# EAGLE design MoteinoPi (EAGLE 6.4)
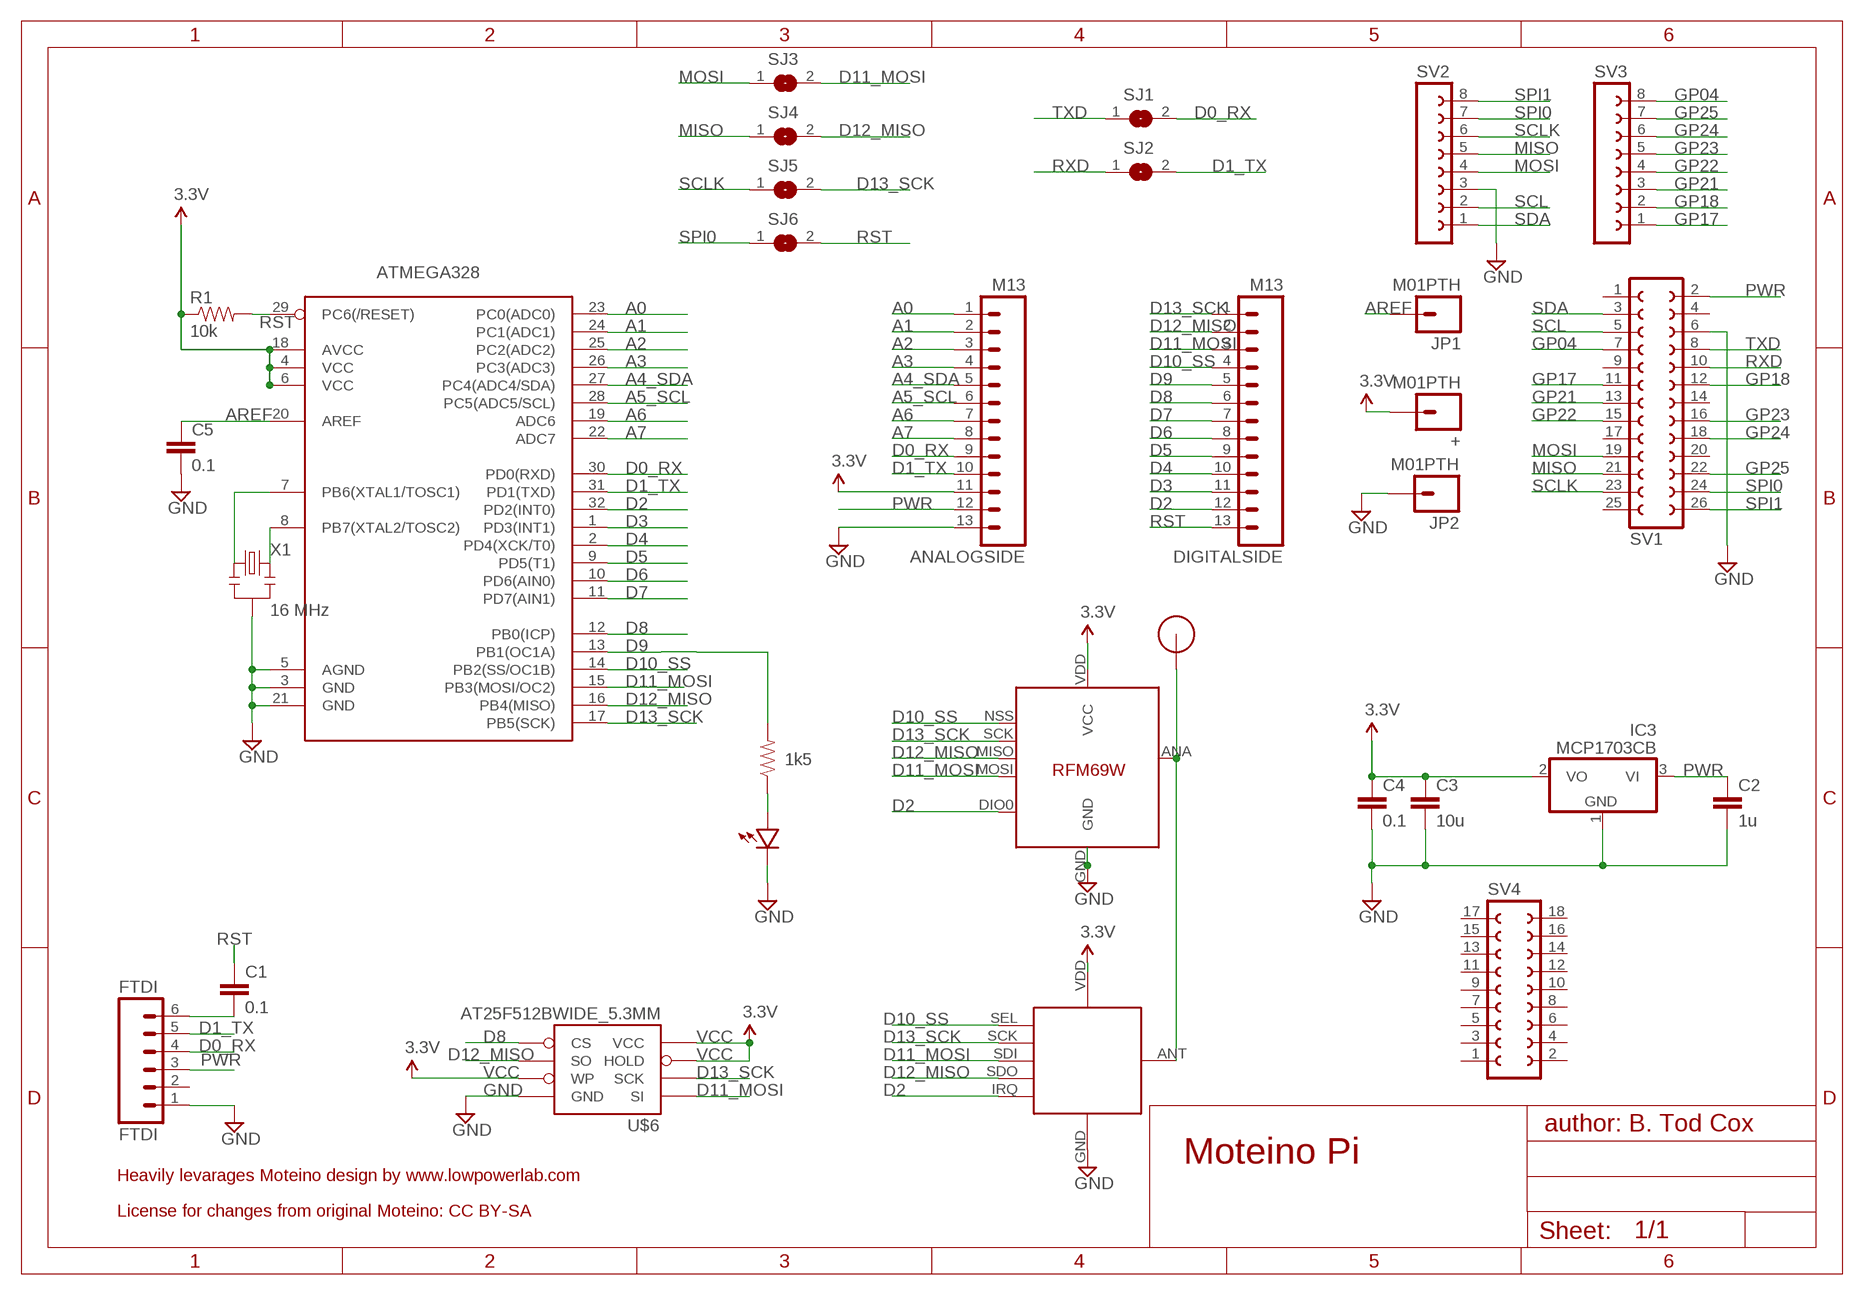
[diagram p0: schematic, sheet 1]

## Parts
+  M01PTH  [1X01]
ANALOGSIDE  M13  [1X13]
ATMEGA328  ATMega-328  ATMEGA168/328TQFP32  [TQFP32-08]
C1  0.1  CAP0603-CAP  [0603-CAP]
C2  1u  CAP0603-CAP  [0603-CAP]
C3  10u  CAP0805-CAP  [0805-CAP]
C4  0.1  CAP0603-CAP  [0603-CAP]
C5  0.1  CAP0603-CAP  [0603-CAP]
DIGITALSIDE  M13  [1X13]
FTDI  FTDI  M06SIP  [1X06]
IC3  MCP1703CB  [SOT23]
JP1  M01PTH  [1X01]
JP2  M01PTH  [1X01]
R1  10k  RESISTOR0603-RES  [0603-RES]
R2  1k5  RESISTOR0603-RES  [0603-RES]
RFM12B  RFM12B_MINPADS  [RFM12B-MINPADS]
SJ1  SJ  [SJ]
SJ2  SJ  [SJ]
SJ3  SJ  [SJ]
SJ4  SJ  [SJ]
SJ5  SJ  [SJ]
SJ6  SJ  [SJ]
SV1  FE13-2  [FE13-2]
SV2  FE08-1  [FE08]
SV3  FE08-1  [FE08]
SV4  FE09-2  [FE09-2]
U$1  RFM12B_ANTENNA  [RFM12B-ANTENNA]
U$2  LED0603  [0603-LED]
U$5  RFM69  [RFM69W-MINPADS]
U$6  AT25F512BWIDE_5.3MM  [SO08WIDE]
X1  16 MHz  RESONATORSMD  [RESONATOR-SMD]

## Nets
A0: ANALOGSIDE.1 ATMEGA328.23(PC0(ADC0))
A1: ANALOGSIDE.2 ATMEGA328.24(PC1(ADC1))
A2: ANALOGSIDE.3 ATMEGA328.25(PC2(ADC2))
A3: ANALOGSIDE.4 ATMEGA328.26(PC3(ADC3))
A4_SDA: ANALOGSIDE.5 ATMEGA328.27(PC4(ADC4/SDA))
A5_SCL: ANALOGSIDE.6 ATMEGA328.28(PC5(ADC5/SCL))
A6: ANALOGSIDE.7 ATMEGA328.19(ADC6)
A7: ANALOGSIDE.8 ATMEGA328.22(ADC7)
AREF: ATMEGA328.20(AREF) C5.1 JP1.1
D0_RX: ANALOGSIDE.9 ATMEGA328.30(PD0(RXD)) FTDI.4 SJ1.2
D1_TX: ANALOGSIDE.10 ATMEGA328.31(PD1(TXD)) FTDI.5 SJ2.2
D2: ATMEGA328.32(PD2(INT0)) DIGITALSIDE.12 RFM12B.IRQ U$5.DIO0
D3: ATMEGA328.1(PD3(INT1)) DIGITALSIDE.11
D4: ATMEGA328.2(PD4(XCK/T0)) DIGITALSIDE.10
D5: ATMEGA328.9(PD5(T1)) DIGITALSIDE.9
D6: ATMEGA328.10(PD6(AIN0)) DIGITALSIDE.8
D7: ATMEGA328.11(PD7(AIN1)) DIGITALSIDE.7
D8: ATMEGA328.12(PB0(ICP)) DIGITALSIDE.6 U$6.1(CS)
D9: ATMEGA328.13(PB1(OC1A)) DIGITALSIDE.5 R2.2
D10_SS: ATMEGA328.14(PB2(SS/OC1B)) DIGITALSIDE.4 RFM12B.SEL U$5.NSS(SEL)
D11_MOSI: ATMEGA328.15(PB3(MOSI/OC2)) DIGITALSIDE.3 RFM12B.SDI(SDI/MOSI) SJ3.2 U$5.MOSI U$6.5(SI)
D12_MISO: ATMEGA328.16(PB4(MISO)) DIGITALSIDE.2 RFM12B.SDO(SDO/MISO) SJ4.2 U$5.MISO U$6.2(SO)
D13_SCK: ATMEGA328.17(PB5(SCK)) DIGITALSIDE.1 RFM12B.SCK SJ5.2 U$5.SCK U$6.6(SCK)
GND: ANALOGSIDE.13 ATMEGA328.3(GND) ATMEGA328.5(AGND) ATMEGA328.21(GND) C2.2 C3.2 C4.2 C5.2 FTDI.1 IC3.1(GND) JP2.1 RFM12B.GND SV1.6 SV2.3 U$2.MINUS U$5.GND U$6.4(GND) X1.2
GP04: SV1.7 SV3.8
GP17: SV1.11 SV3.1
GP18: SV1.12 SV3.2
GP21: SV1.13 SV3.3
GP22: SV1.15 SV3.4
GP23: SV1.16 SV3.5
GP24: SV1.18 SV3.6
GP25: SV1.22 SV3.7
MISO: SJ4.1 SV1.21 SV2.5
MOSI: SJ3.1 SV1.19 SV2.4
N$1: ATMEGA328.7(PB6(XTAL1/TOSC1)) X1.1
N$2: R2.1 U$2.PLUS
N$3: RFM12B.ANT U$1.P$1 U$5.ANA(ANT)
N$20: C1.2 FTDI.6
N$21: ATMEGA328.8(PB7(XTAL2/TOSC2)) X1.3
PWR [power]: ANALOGSIDE.12 C2.1 FTDI.3 IC3.3(VI) SV1.2
RST: ATMEGA328.29(PC6(/RESET)) C1.1 DIGITALSIDE.13 R1.2 SJ6.2
RXD: SJ2.1 SV1.10
SCL: SV1.5 SV2.2
SCLK: SJ5.1 SV1.23 SV2.6
SDA: SV1.3 SV2.1
SPI0: SJ6.1 SV1.24 SV2.7
SPI1: SV1.26 SV2.8
TXD: SJ1.1 SV1.8
VCC: +.1 ANALOGSIDE.11 ATMEGA328.4(VCC) ATMEGA328.6(VCC) ATMEGA328.18(AVCC) C3.1 C4.1 IC3.2(VO) R1.1 RFM12B.VDD U$5.VDD(VCC) U$6.3(WP) U$6.7(HOLD) U$6.8(VCC) ; supply symbol labelled 3.3V
Unconnected: FTDI.2 SV1.1 SV1.4 SV1.9 SV1.14 SV1.17 SV1.20 SV1.25 SV4.1 SV4.2 SV4.3 SV4.4 SV4.5 SV4.6 SV4.7 SV4.8 SV4.9 SV4.10 SV4.11 SV4.12 SV4.13 SV4.14 SV4.15 SV4.16 SV4.17 SV4.18

## Notes on the sheet
- author: B. Tod Cox
- Moteino Pi
- Heavily levarages Moteino design by www.lowpowerlab.com
- License for changes from original Moteino: CC BY-SA

## Library data of the parts
+ JP1 JP2 = SparkFun-Connectors:M01: Header 1 Standard 1-pin 0.1" header. Use with straight break away headers (SKU : PRT-00116), right angle break away headers (PRT-00553), swiss pins (PRT-00743), machine pins (PRT-00117), and female headers (PRT-00115).
ANALOGSIDE DIGITALSIDE = SparkFun-Connectors:M13: 13-pin single row .1" header
ATMEGA328 = LowPowerLab:ATMEGA168/328: Atmel 32-pin 8-bit micro, 16k flash.
C1-C5 = LowPowerLab:CAP: Capacitor Standard 0603 ceramic capacitor, and 0.1" leaded capacitor.
FTDI = SparkFun-Connectors:M06: Header 6 Standard 6-pin 0.1" header. Use with straight break away headers (SKU : PRT-00116), right angle break away headers (PRT-00553), swiss pins (PRT-00743), machine pins (PRT-00117), and female headers (PRT-00115). Molex polarized connector foot print use with SKU : PRT-08094 with associated crimp pins and housings. NOTES ON THE VARIANTS LOCK and LOCK_LONGPADS... This footprint was designed to help hold the alignment of a through-hole component (i.e. 6-pin header) while soldering it into place. You may notice that each hole has been shifted either up or down by 0.005 of an inch from it's more standard position (which is a perfectly straight line). This slight alteration caused the pins (the squares in the middle) to touch the edges of the holes. Because they are alternating, it causes a "brace" to hold the component in place. 0.005 has proven to be the perfect amount of "off-center" position when using our standard breakaway headers. Although looks a little odd when you look at the bare footprint, once you have a header in there, the alteration is very hard to notice. Also, if you push a header all the way into place, it is covered up entirely on the bottom side. This idea of altering the position of holes to aid alignment will be further integrated into the Sparkfun Library for other footprints. It can help hold any component with 3 or more connection pins.
IC3 = linear:MCP1703: 250 mA, 16V, Low Quiescent Current LDO Regulator Source: http://ww1.microchip.com/downloads/en/DeviceDoc/22049b.pdf
R1 R2 = LowPowerLab:RESISTOR: Resistor Basic schematic elements and footprints for 0603, 1206, and PTH resistors.
RFM12B = LowPowerLab:RFM12B_MINPADS
SJ1-SJ6 = jumper:SJ: SMD solder JUMPER
SV1 = con-lsta:FE13-2: FEMALE HEADER; OC_FARNELL: unknown; OC_NEWARK: unknown
SV2 SV3 = con-lsta:FE08-1: FEMALE HEADER; OC_FARNELL: unknown; OC_NEWARK: unknown
SV4 = con-lsta:FE09-2: FEMALE HEADER; OC_FARNELL: unknown; OC_NEWARK: unknown
U$1 = LowPowerLab:RFM12B_ANTENNA
U$2 = LowPowerLab:LED
U$5 = LowPowerLab:RFM69
U$6 = LowPowerLab:AT25F512B: 4-Mbit SPI flash memory
X1 = SparkFun:RESONATOR: Resonator Small SMD resonator. This is the itty bitty 10/20MHz resonators with built in caps. CSTCE10M0G55 and CSTCE20M0V53. Footprint has been reviewed closely but hasn't been tested yet.

## Net classes
1 power: width 0.381 mm

## Board
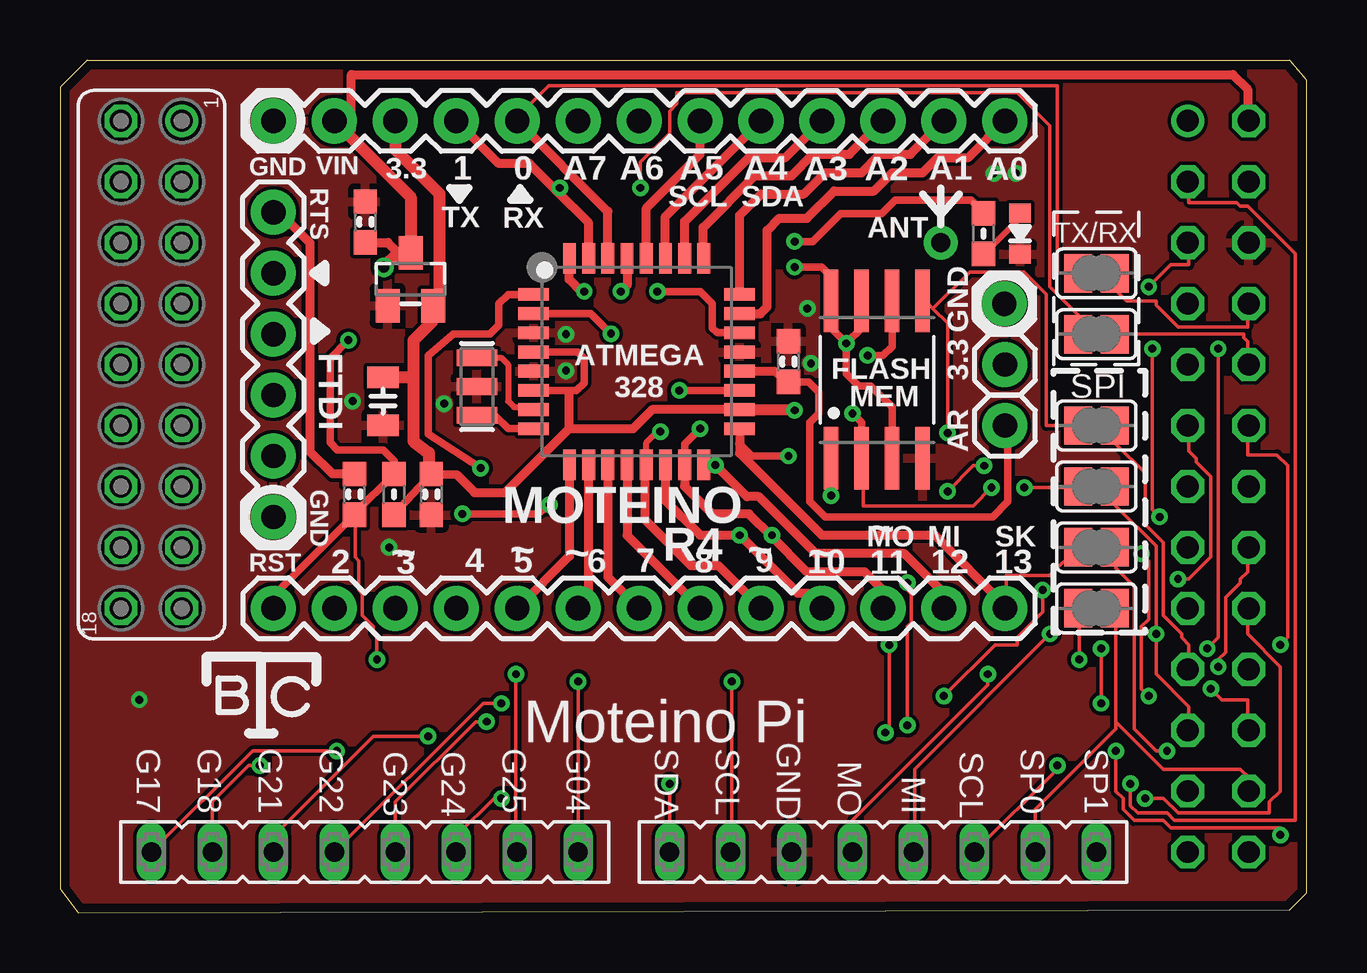
[diagram p1: board, top side]
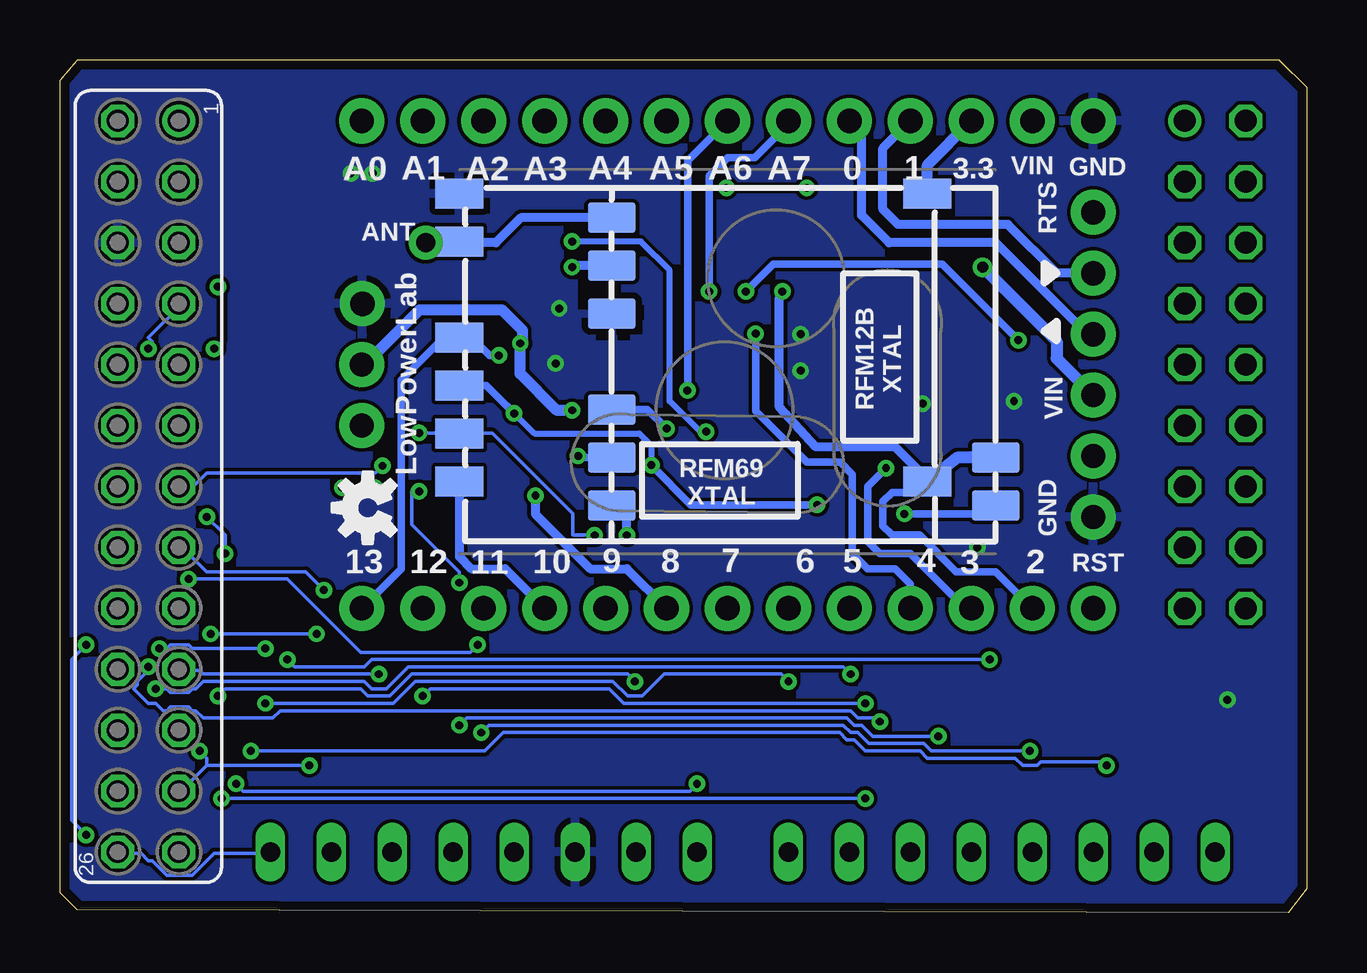
[diagram p2: board, bottom side, seen from below]

Size 51.94 x 35.56 mm. Coordinates in mm from the lower left corner, seen from the top.
Outline: 0.76,0 51.23,0.13 51.94,0.84 51.94,34.72 51.23,35.56 1.14,35.56 0,34.42 0,1.02 0.76,0
Copper layers (1*16): Top 0.0356mm / dielectric 1.5011mm / Bottom 0.0356mm
Design rules "LaenPCBOrder": minimum track width 6mil, minimum drill 13mil, track to track 6mil, track to pad 6mil, pad to pad 6mil, via to via 6mil, smd to smd 6mil, copper to edge 15mil, drill to drill 6mil, minimum pad ring 7mil, minimum via ring 7mil, stop-mask expansion 3mil, vias tented up to drill 0mil, thermal gap 10mil
tRestrict: area 31.8,20.2 to 36.6,24.1; area 13.3,28.2 to 14.4,29.8; area 12.7,21 to 14.2,21.7
bRestrict: area 28.6,25.1 to 30.4,26.2; area 29.1,23.9 to 29.6,24.5; area 28.2,23.9 to 28.7,24.5; area 27.7,24.1 to 28.2,24.8; area 27.6,24.7 to 28.1,25.3; area 34,29.2 to 34.5,29.8

### Footprints (pad centres in the part's own frame; a part is rotated, then mirrored left to right if it is on the bottom)
1X01 = drill 1.016 pad 1.88: 1 0,0
1X13 = drill 1.016 pad 1.88: 1 0,0; 2 2.54,0; 3 5.08,0; 4 7.62,0; 5 10.16,0; 6 12.7,0; 7 15.24,0; 8 17.78,0; 9 20.32,0; 10 22.86,0; 11 25.4,0; 12 27.94,0; 13 30.48,0
TQFP32-08 = smd 1.27 x 0.533: 1 -4.293,2.8; 2 -4.293,2; 3 -4.293,1.2; 4 -4.293,0.4; 5 -4.293,-0.4; 6 -4.293,-1.2; 7 -4.293,-2; 8 -4.293,-2.8; 17 4.293,-2.8; 18 4.293,-2; 19 4.293,-1.2; 20 4.293,-0.4; 21 4.293,0.4; 22 4.293,1.2; 23 4.293,2; 24 4.293,2.8 | smd 0.533 x 1.27: 9 -2.8,-4.293; 10 -2,-4.293; 11 -1.2,-4.293; 12 -0.4,-4.293; 13 0.4,-4.293; 14 1.2,-4.293; 15 2,-4.293; 16 2.8,-4.293; 25 2.8,4.293; 26 2,4.293; 27 1.2,4.293; 28 0.4,4.293; 29 -0.4,4.293; 30 -1.2,4.293; 31 -2,4.293; 32 -2.8,4.293
0603-CAP = smd 1.016 x 0.965: 1 -0.85,0; 2 0.85,0
0805-CAP = smd 0.902 x 1.3: 1 -1,0; 2 1,0
1X06 = drill 1.016 pad 1.88: 1 0,0; 2 2.54,0; 3 5.08,0; 4 7.62,0; 5 10.16,0; 6 12.7,0
SOT23 = smd 1 x 1.4: 1 -0.95,-1.1; 2 0.95,-1.1; 3 0,1.1
0603-RES = smd 1.016 x 0.965: 1 -0.85,0; 2 0.85,0
RFM12B-MINPADS = smd 2 x 1.27: ANT 8,-6; GND 8,-2; IRQ -8,4; SCK 8,4; SDI 8,2; SDO -8,6; SEL 8,6; VDD 8,-4
SJ = smd 1.168 x 1.6: 1 -0.762,0; 2 0.762,0
FE13-2 = drill 0.914: 1 -15.24,1.27 | drill 0.914 octagon: 2 -15.24,-1.27; 3 -12.7,1.27; 4 -12.7,-1.27; 5 -10.16,1.27; 6 -10.16,-1.27; 7 -7.62,1.27; 8 -7.62,-1.27; 9 -5.08,1.27; 10 -5.08,-1.27; 11 -2.54,1.27; 12 -2.54,-1.27; 13 0,1.27; 14 0,-1.27; 15 2.54,1.27; 16 2.54,-1.27; 17 5.08,1.27; 18 5.08,-1.27; 19 7.62,1.27; 20 7.62,-1.27; 21 10.16,1.27; 22 10.16,-1.27; 23 12.7,1.27; 24 12.7,-1.27; 25 15.24,1.27; 26 15.24,-1.27
FE08 = drill 0.813 long: 1 -8.89,0; 2 -6.35,0; 3 -3.81,0; 4 -1.27,0; 5 1.27,0; 6 3.81,0; 7 6.35,0; 8 8.89,0
FE09-2 = drill 0.914: 1 -10.16,1.27 | drill 0.914 octagon: 2 -10.16,-1.27; 3 -7.62,1.27; 4 -7.62,-1.27; 5 -5.08,1.27; 6 -5.08,-1.27; 7 -2.54,1.27; 8 -2.54,-1.27; 9 0,1.27; 10 0,-1.27; 11 2.54,1.27; 12 2.54,-1.27; 13 5.08,1.27; 14 5.08,-1.27; 15 7.62,1.27; 16 7.62,-1.27; 17 10.16,1.27; 18 10.16,-1.27
RFM12B-ANTENNA = drill 0.8 pad 1.422: P$1 0,0
0603-LED = smd 0.8 x 0.9: MINUS -0.85,0; PLUS 0.85,0
RFM69W-MINPADS = smd 2 x 1.27: ANA 8,-5; DIO0 -11.5,5; GND 8,-7; MISO 8,1; MOSI 8,3; NSS 8,5; SCK 8,-1; VDD -11.5,-7
SO08WIDE = smd 0.61 x 2.6: 1 -1.905,-3.269; 2 -0.635,-3.269; 3 0.635,-3.269; 4 1.905,-3.269; 5 1.905,3.286; 6 0.635,3.286; 7 -0.635,3.286; 8 -1.905,3.286
RESONATOR-SMD = smd 0.7 x 1.7: 1 -1.2,0; 2 0,0; 3 1.2,0

### Placement (x,y rotation side)
+  39.37,22.86 270 top
ANALOGSIDE  39.37,33.02 180 top
ATMEGA328  24.03,22.99 0 top
C1  12.27,17.45 90 top
C2  12.73,28.8 90 top
C3  13.46,21.34 270 top
C4  15.47,17.45 270 top
C5  30.35,22.99 90 top
DIGITALSIDE  39.37,12.7 180 top
FTDI  8.89,16.51 90 top
IC3  14.61,26.42 0 top
JP1  39.37,20.32 0 top
JP2  39.34,25.4 0 top
R1  13.92,17.45 90 top
R2  38.48,28.32 90 top
RFM12B  20.96,22.99 180 bottom
SJ1  43.18,26.67 180 top
SJ2  43.18,24.13 180 top
SJ3  43.18,20.32 180 top
SJ4  43.18,17.78 180 top
SJ5  43.18,15.24 180 top
SJ6  43.18,12.7 180 top
SV1  48.26,17.78 270 bottom
SV2  34.29,2.54 0 top
SV3  12.7,2.54 0 top
SV4  3.81,22.86 270 top
U$1  36.7,27.94 0 top
U$2  40,28.32 90 top
U$3  [OSHW-LOGO-S]  39.12,16.89 90 bottom
U$5  27.3,22.99 180 bottom
U$6  34.04,22.22 0 top
X1  17.37,21.95 270 top

### Tracks (layer width: path | path; a pad name or v marks a point on that pad's centre or on a via)
A0
  Top 0.381: ATMEGA328.23 29.18,24.99 29.46,25.27 29.46,28.45 29.97,28.96 31.11,28.96 32.26,30.1 33.91,30.1 34.67,30.86 35.94,30.86 36.58,31.5 37.85,31.5 ANALOGSIDE.1
A1
  Top 0.381: ATMEGA328.24 28.32,29.08 29.21,29.97 30.99,29.97 31.88,30.86 33.4,30.86 34.16,31.62 35.43,31.62 ANALOGSIDE.2
A2
  Top 0.381: ATMEGA328.25 26.8,27.28 26.8,28.57 28.96,30.73 30.48,30.73 31.37,31.62 32.89,31.62 ANALOGSIDE.3
A3
  Top 0.381: ATMEGA328.26 26.03,28.82 28.7,31.5 30.23,31.5 ANALOGSIDE.4
A4_SDA
  Top 0.381: ATMEGA328.27 25.23,29.04 ANALOGSIDE.5
A5_SCL
  Top 0.381: ATMEGA328.28 24.43,29.38 26.67,31.62 ANALOGSIDE.6
A6  (via drill 0.33)
  Top 0.305: ATMEGA328.19 v25.8,21.79
  Bottom 0.305: 25.78,21.72 25.78,31.37 ANALOGSIDE.7
  Bottom 0.381: 25.78,21.72 v25.8,21.79
A7  (via drill 0.33)
  Top 0.305: ATMEGA328.22 27.38,24.19 27.18,24.38 27.18,25.4 26.67,25.91 v24.89,25.91
  Bottom 0.305: v24.89,25.91 24.89,30.73 24.13,31.5 22.99,31.5 21.59,32.89 ANALOGSIDE.8
AREF
  Top 0.305: C5.1 31.2,22.14 31.62,21.72 31.62,20.83 31.24,20.45 31.24,17.14 31.88,16.51 38.86,16.51 39.5,17.14 39.5,20.19 JP1.1
  Top 0.381: ATMEGA328.20 29.78,22.59 C5.1
D0_RX
  Top 0.152: 42.47,26.72 SJ1.2 41.55,26.67 41.55,34.49 20.37,34.49 19.05,33.17
  Top 0.305: 19.05,33.17 ANALOGSIDE.9
  Top 0.381: ATMEGA328.30 22.83,29.24 ANALOGSIDE.9
  Bottom 0.381: FTDI.4 9.14,24.13 12.95,27.94 17.4,27.94 18.54,29.08 18.54,32.51 ANALOGSIDE.9
D1_TX  (via drill 0.33)
  Top 0.152: v24.18,30.23 24.18,31.29 25.4,32.51 25.4,33.43 25.71,33.73 25.71,34.19 39.88,34.19 41.25,32.82 41.25,26.11 42.47,24.89 42.47,24.13 SJ2.2 | v20.83,30.23 20.7,30.1
  Top 0.381: ATMEGA328.31 22.03,28.77 20.7,30.1 19.56,31.24 18.29,31.24 ANALOGSIDE.10
  Bottom 0.152: v20.83,30.23 v24.18,30.23
  Bottom 0.381: FTDI.5 10.41,26.67 12.45,28.7 17.02,28.7 17.65,29.34 17.65,31.88 ANALOGSIDE.10
D2  (via drill 0.33)
  Top 0.381: v21.84,25.91 21.72,25.91 21.21,26.42 21.21,27.13 ATMEGA328.32
  Bottom 0.305: DIGITALSIDE.12 12.95,14.22 14.61,14.22 16.13,15.75 17.27,15.75 17.65,16.13 17.65,17.14 17.27,17.53 16.27,17.53 U$5.DIO0
  Bottom 0.381: 15.34,18.19 15.91,18.19 17.14,19.43 20.45,19.43 21.97,21.08 21.97,25.65 v21.84,25.91
  Bottom 0.406: U$5.DIO0 15.55,17.99 15.34,18.19
  Bottom 0.508: RFM12B.IRQ 14.55,18.99 U$5.DIO0
D3  (via drill 0.33)
  Top 0.305: v17.53,18.54 15.34,19.96 15.34,23.24 16.38,24.13 17.91,24.13 18.29,24.51 18.29,25.4 18.67,25.78 ATMEGA328.1
  Top 0.381: ATMEGA328.1
  Bottom 0.305: DIGITALSIDE.11 14.22,12.7 16.51,14.99 17.78,14.99 18.29,15.49 18.29,17.78 v17.53,18.54
D4  (via drill 0.33)
  Top 0.305: ATMEGA328.2 22.12,24.99 v22.96,24.15
  Top 0.381: 19.66,25.04 ATMEGA328.2
  Bottom 0.305: DIGITALSIDE.10 16.51,13.72 17.14,14.35 18.29,14.35 18.92,14.99 18.92,18.29 19.43,18.8 20.83,18.8 22.96,20.93 v22.96,24.15
D5
  Top 0.381: ATMEGA328.9 21.23,14.88 DIGITALSIDE.9
D6
  Top 0.381: DIGITALSIDE.8 22.03,13.14 ATMEGA328.10
D7
  Top 0.381: ATMEGA328.11 22.83,14 DIGITALSIDE.7
D8  (via drill 0.33)
  Top 0.305: v32.13,17.4 32.12,19.05 U$6.1
  Top 0.381: ATMEGA328.12 23.63,15.74 DIGITALSIDE.6
  Bottom 0.381: v32.13,17.4 32.13,16.64 29.84,14.35 28.32,14.35 DIGITALSIDE.6
D9  (via drill 0.33)
  Top 0.254: ATMEGA328.13 24.43,19.6 24.89,20.07 v25.02,20.07
  Top 0.305: R2.2 38.26,29.43 37.97,29.72 34.8,29.72 34.24,29.16 32.54,29.16 31.37,27.99 v30.61,27.99
  Top 0.381: ATMEGA328.13 24.38,18.61 24.38,16.38 26.29,14.48 27.43,14.48 DIGITALSIDE.5
  Bottom 0.254: v25.02,20.07 25.27,20.07 26.54,21.34 26.54,26.8 27.74,27.99 v30.61,27.99
D10_SS  (via drill 0.33)
  Top 0.381: ATMEGA328.14 25.23,17.19 26.67,15.75 v28.32,15.75 30.73,13.33 31.11,13.33 DIGITALSIDE.4
  Bottom 0.254: 28.32,16.73 RFM12B.SEL
  Bottom 0.381: v28.32,15.75 28.32,16.73 | U$5.NSS 35.3,14.86 34.8,14.35 33.4,14.35 DIGITALSIDE.4
D11_MOSI  (via drill 0.33)
  Top 0.152: 36.37,25.2 36.98,24.59 v36.98,20.02 | 36.37,25.2 36.07,25.5 U$6.5 | v29.67,15.75 29.63,15.71 | SJ3.2 41.1,20.32 41.1,25.81 40.18,26.72 37.9,26.72 36.37,25.2
  Top 0.305: ATMEGA328.15 26.03,19.55 v26.67,20.19
  Top 0.381: ATMEGA328.15 26.03,17.79 27.18,16.64 28.7,16.64 29.63,15.71 31.11,14.22 33.53,14.22 34.29,13.46 DIGITALSIDE.3
  Bottom 0.152: v36.98,20.02 35.31,20.02 U$5.MOSI 35.15,20.02 33.93,20.02 30.58,16.66 30.58,15.75 v29.67,15.75
  Bottom 0.305: v26.67,20.19 27.46,20.99 RFM12B.SDI
D12_MISO  (via drill 0.33)
  Top 0.152: v40.18,17.73 42.32,17.73 SJ4.2 | v38.81,17.73 38.05,16.97 33.48,16.97 33.48,18.95 U$6.2
  Top 0.305: v33.02,20.83 33.4,20.45 U$6.2 | v16.76,16.64 19.89,16.64 v20.4,17.02
  Top 0.381: ATMEGA328.16 27.41,18.69 v27.3,18.67 28.62,17.36 29.12,17.36 31.5,14.99 35.18,14.99 36.83,13.33 DIGITALSIDE.2
  Bottom 0.152: v38.81,17.73 v40.18,17.73
  Bottom 0.254: v33.02,20.83 32.18,19.99 27.81,19.99 27.3,19.48 v27.3,18.67
  Bottom 0.305: U$5.MISO 34.18,21.99 v33.02,20.83 33.34,21.14 | v27.3,18.67 25.65,17.02 v20.4,17.02 | v16.76,16.64 13.3,16.64 RFM12B.SDO
D13_SCK  (via drill 0.33)
  Top 0.152: SJ5.2 41.25,14.07 39.42,14.07 39.42,13 DIGITALSIDE.1
  Top 0.305: v33.65,23.24 34.29,23.24 34.67,23.62 U$6.6 | v30.35,19.05 28.83,19.05 28.32,19.56
  Top 0.381: DIGITALSIDE.1 39.37,12.83 36.45,15.75 31.74,15.75 28.32,19.17 28.32,19.56 ATMEGA328.17
  Bottom 0.305: RFM12B.SCK 30.29,18.99 v30.35,19.05 | DIGITALSIDE.1 37.72,14.35 37.72,22.22 35.96,23.99 U$5.SCK 35.29,24 34.8,24 34.04,23.24 v33.65,23.24
GND  (via drill 0.33 pad 0.69)
  other vias: 3.3,8.89 13.72,15.24 12.19,21.34 21.08,22.61 21.08,24.13 16,21.23 31.29,22.91 31.14,25.2 38.91,30.84 39.83,30.84
  pour Bottom: 0.51,35.31 0.51,0.38 51.69,0.38 51.69,35.31
  pour Top: 0.51,35.31 0.51,0.38 51.69,0.38 51.69,35.31
GP04  (via drill 0.33)
  Top 0.152: v21.59,9.65 SV3.8 | v43.38,11.02 v43.38,8.74 | v47.8,11.02 48.26,11.48 v48.26,23.52
  Bottom 0.152: v21.59,9.65 21.89,9.96 26.77,9.96 27.69,9.04 28.3,9.04 28.91,9.65 37.13,9.65 38.05,8.74 v43.38,8.74 | v43.38,11.02 46.43,11.02 46.58,11.18 47.35,11.18 47.5,11.02 v47.8,11.02 | v48.26,23.52 48.26,23.67 48.11,23.82 48.26,23.98 46.89,25.35 SV1.7
GP17  (via drill 0.33)
  Top 0.152: SV3.1 8.03,6.76 v11.53,6.76 | v34.39,7.52 34.54,7.67 v34.54,11.18 | v46.58,13.92 47.04,13.92 47.95,14.83 47.95,18.19 47.35,18.8 47.35,18.95 47.04,19.25 47.04,20.32 SV1.11
  Bottom 0.152: v11.53,6.76 15.65,6.76 15.95,7.06 18.24,7.06 18.69,7.52 19,7.52 19.3,7.82 34.09,7.82 v34.39,7.52 | v34.54,11.18 34.85,10.87 39.42,10.87 42.47,13.92 v46.58,13.92
GP18  (via drill 0.33)
  Top 0.152: SV3.2 6.35,4.62 7.87,6.15 v8.33,6.15 | v43.99,6.76 43.99,5.08 44.3,4.78 44.3,4.32 44.75,3.86 45.97,3.86 46.28,3.56 50.85,3.56 v50.85,3.25 | v50.85,11.18 51.16,11.48 51.16,18.64 50.7,19.1 49.48,19.1 49.48,20.32 SV1.12
  Bottom 0.152: v8.33,6.15 8.48,6.3 11.07,6.3 11.23,6.15 11.84,6.15 12.14,6.45 15.8,6.45 16.1,6.76 18.39,6.76 18.85,7.21 19.15,7.21 19.46,7.52 33.48,7.52 34.24,6.76 v43.99,6.76 | v50.85,3.25 51.46,3.86 51.46,10.57 v50.85,11.18
GP21  (via drill 0.33)
  Top 0.152: v15.34,7.37 13.06,7.37 8.94,3.25 8.94,2.64 SV3.3 | v35.31,7.82 35.31,11.94 35.46,12.09 35.46,13.31 35.31,13.46 v35.31,13.77 | v36.98,17.58 38.05,18.64 v38.51,18.64
  Bottom 0.152: v15.34,7.37 18.09,7.37 18.54,7.82 18.85,7.82 19.15,8.13 35,8.13 v35.31,7.82 | v35.31,13.77 35.31,14.22 37.29,16.21 37.29,17.58 v36.98,17.58 | v38.51,18.64 38.81,18.34 45.82,18.34 46.43,17.73 46.89,17.73 SV1.13
GP22  (via drill 0.33)
  Top 0.152: SV3.4 17.63,8.74 v18.39,8.74 | v36.83,9.04 38.96,11.18 39.88,11.18 39.88,11.48 40.95,12.55 v40.95,13.46
  Bottom 0.152: v18.39,8.74 28.45,8.74 29.06,9.35 36.52,9.35 v36.83,9.04 | v40.95,13.46 41.71,14.22 45.82,14.22 46.74,15.14 46.74,15.29 46.89,15.29 SV1.15
GP23  (via drill 0.33)
  Top 0.152: SV3.5 13.97,4.62 17.32,7.98 v17.78,7.98 | v48.26,10.26 48.26,10.57 48.56,10.87 48.56,13.16 49.17,13.77 49.17,13.92 49.48,14.22 49.48,15.14 SV1.16
  Bottom 0.152: v17.78,7.98 17.93,8.13 18.69,8.13 19,8.43 42.77,8.43 43.08,8.13 45.97,8.13 46.28,8.43 46.43,8.43 46.58,8.59 47.35,8.59 47.5,8.43 47.65,8.43 47.95,8.74 48.26,8.74 48.87,9.35 48.72,9.5 48.72,9.65 48.41,9.96 48.41,10.11 v48.26,10.26
GP24  (via drill 0.33)
  Top 0.152: v18.39,4.78 18.09,4.78 16.56,3.25 16.56,2.64 SV3.6 | v45.21,4.78 45.97,4.78 46.58,4.17 50.39,4.17 50.39,4.62 50.85,5.08 50.85,10.26 49.48,11.63 49.48,12.7 SV1.18
  Bottom 0.152: v45.21,4.78 v18.39,4.78
GP25  (via drill 0.33)
  Top 0.152: v19,9.96 19,2.64 SV3.7 | v47.95,9.35 48.41,8.89 49.48,8.89 49.48,7.67 SV1.22
  Bottom 0.152: v19,9.96 19.3,10.26 37.44,10.26 38.35,9.35 38.96,9.35 39.27,9.65 45.97,9.65 46.28,9.35 46.43,9.35 46.58,9.2 47.35,9.2 47.5,9.35 v47.95,9.35
MISO  (via drill 0.33)
  Top 0.152: SJ4.1 43.99,17.73 43.99,16.97 45.67,15.29 v45.67,11.63 45.67,9.96 47.04,8.59 47.04,7.67 SV1.21 | v41.25,11.63 35.61,5.99 35.61,2.64 SV2.5
  Bottom 0.152: v45.67,11.63 v41.25,11.63
MOSI  (via drill 0.33)
  Top 0.152: SJ3.1 43.99,20.32 43.99,19.56 45.21,18.34 45.21,16.21 45.97,15.44 45.97,12.39 46.74,11.63 46.74,11.48 47.04,11.18 47.04,10.26 SV1.19 | SV2.4 33.02,3.86 38.66,9.5 v38.66,9.96
  Bottom 0.152: v38.66,9.96 45.97,9.96 46.13,10.11 46.89,10.11 SV1.19
N$1
  Top 0.254: X1.1 18.38,23.15 18.67,22.86 18.67,21.34 18.92,21.08 19.64,21.08 ATMEGA328.7
N$2
  Top 0.254: R2.1 39.88,28.87 U$2.PLUS
N$3
  Bottom 0.381: U$1.P$1 35.99,27.99 U$5.ANA 35,27.94 33.78,27.94 32.73,28.99 RFM12B.ANT
N$20
  Top 0.381: C1.2 11.36,18.3 10.41,19.24 10.41,27.94 9.14,29.21 FTDI.6
N$21
  Top 0.305: X1.3 18.12,20.75 18.67,20.19 ATMEGA328.8
PWR  (via drill 0.46 pad 0.81)
  Top 0.381: C2.1 13.66,27.95 14.1,27.52 | SV1.2 49.48,33.12 49.48,34.34 48.87,34.95 12.14,34.95 12.14,32.66 ANALOGSIDE.12
  Top 0.508: ANALOGSIDE.12 14.61,29.84 IC3.3 14.1,27.52 v13.5,26.92
  Bottom 0.508: FTDI.3 10.41,23.11 10.41,23.84 v13.5,26.92
RST  (via drill 0.33, 0.33 pad 0.69)
  Top 0.152: v42.47,10.57 42.47,12.7 SJ6.2 | v13.21,10.57 13.21,11.48 13.06,11.63 13.06,11.94 12.6,12.39 12.6,13.31 12.45,13.46 12.45,14.68 12.29,14.83 12.29,16.51 C1.1
  Top 0.305: DIGITALSIDE.13 8.89,13.22 C1.1 12.27,16.65 R1.2 13.92,18.85 13.46,19.3 11.56,19.3 11.25,19.61 11.25,23.11 v12.01,23.88
  Top 0.381: ATMEGA328.29 23.63,26.17 v23.37,25.91
  Bottom 0.152: v42.47,10.57 42.16,10.26 39.27,10.26 38.96,10.57 v13.21,10.57
  Bottom 0.305: v23.37,25.91 22.23,27.05 15.19,27.05 v12.01,23.88
RXD
  Top 0.152: SJ2.1 49.33,24.13 49.33,23.98 49.48,23.82 49.48,22.91 SV1.10
SCL  (via drill 0.33)
  Top 0.152: v27.99,9.65 27.99,2.64 SV2.2 | v45.36,9.04 45.06,9.35 45.06,11.94 45.36,12.24 45.36,14.68 v45.06,14.99 | v45.82,16.51 45.52,16.82 v45.52,23.52 | v45.36,26.11 46.28,27.03 47.04,27.03 47.04,27.94 SV1.5
  Bottom 0.152: v27.99,9.65 28.3,9.96 37.29,9.96 38.2,9.04 39.12,9.04 39.42,9.35 45.06,9.35 v45.36,9.04 | v45.06,14.99 45.06,15.75 v45.82,16.51 | v45.52,23.52 45.21,23.82 45.21,25.96 v45.36,26.11
SCLK  (via drill 0.33)
  Top 0.152: v46.13,6.76 45.67,6.76 44.75,7.67 44.75,13.61 43.99,14.38 43.99,15.14 SJ5.1 | SV2.6 41.55,5.99 v41.55,6.15
  Bottom 0.152: v46.13,6.76 45.82,6.45 45.82,6.15 | 45.82,6.15 46.74,5.23 46.74,5.08 SV1.23 | 45.82,6.15 v41.55,6.15
SDA  (via drill 0.33)
  Top 0.152: v25.4,5.38 SV2.1 | v44.6,5.38 44.6,4.47 44.91,4.17 46.13,4.17 46.43,3.86 51.46,3.86 51.46,27.48 49.48,29.46 49.17,29.46 49.02,29.62 47.04,29.62 47.04,30.38 SV1.3
  Bottom 0.152: v25.4,5.38 25.71,5.08 44.3,5.08 v44.6,5.38
SPI0
  Top 0.152: 43.99,7.98 43.99,7.67 40.64,4.32 SV2.7 | 43.99,7.98 43.99,12.7 SJ6.1 | 43.99,7.98 45.97,5.99 49.17,5.99 49.48,5.69 49.48,5.08 SV1.24
SPI1
  Bottom 0.152: SV1.26 49.48,2.49 48.56,2.49 48.26,2.18 48.11,2.18 47.5,1.57 46.43,1.57 45.52,2.49 43.23,2.49 SV2.8
TXD
  Top 0.152: SJ1.1 43.99,26.57 43.99,25.96 44.45,25.5 45.67,25.5 45.67,25.35 46.58,24.43 49.48,24.43 49.48,25.35 SV1.8
VCC  (via drill 0.33)
  Top 0.305: ATMEGA328.4 21.57,23.39 21.84,23.11 21.84,22.1 21.52,21.79 21.34,21.79 | ATMEGA328.6 21.34,21.79 | v32.77,23.75 32.13,24.38 U$6.8 | v32.77,23.75 33.4,24.38 U$6.7 | v32.77,23.75 32.77,22.48 33.27,21.97 33.78,21.97 34.67,21.08 U$6.3 | v30.61,26.92 31.73,26.92 32.13,26.53 | 21.21,21.66 21.34,21.79 | R1.1 13.92,16.62 C4.1
  Top 0.381: 32.13,26.53 U$6.8 | ATMEGA328.18 24.67,20.99 23.88,20.19 21.21,20.19 | 21.21,20.19 21.21,21.66 | C4.1 16.52,18.27 17.27,17.53 18.54,17.53 21.21,20.19
  Top 0.457: ATMEGA328.18 30.7,20.99 v30.61,20.95
  Top 0.508: C4.1 15.37,18.38 15.37,19.18 14.73,19.66 14.73,22.35 | 14.73,22.35 14.73,23.88 15.49,24.64 15.49,25.25 IC3.2 | C3.1 14.72,22.34 14.73,22.35 | IC3.2 15.73,25.15 | ANALOGSIDE.11 13.97,31.82 U$5.VDD 15.8,25.57 IC3.2
  Top 0.635: 15.73,25.04 15.73,25.15
  Bottom 0.381: RFM12B.VDD 30.67,26.99 v30.61,26.92
  Bottom 0.457: +.1 39.24,22.86 36.96,25.15 33.53,25.15 32.68,24.29 32.68,23.84 v32.77,23.75 32.77,22.48 31.24,20.95 v30.61,20.95 | U$5.VDD 15.8,31.18 ANALOGSIDE.11

### Text on the board
tPlace: MOTEINO | R4
bPlace: RFM12B / XTAL | LowPowerLab | RFM69 / XTAL
tDocu: REG
_tsilk: VIN | 3.3 | 1 | 0 | A7 | A6 | A5 | A4 | A3 | A2 | A1 | GND | RTS | A0 | TX | RX | SCL | SDA | ANT | TX/RX | GND | 3.3 | FLASH | ATMEGA / 328 | MEM | AR | SPI | FTDI | GND | 2 | 3 | 4 | 5 | 6 | 7 | 8 | 9 | 10 | MO | ~ | 11 | MI | 12 | SK | 13 | RST | ~ | ~ | ~ | ~ | ~ | G17 | G18 | G21 | G22 | G25 | Moteino Pi | G04 | SDA | SCL | GND | SP0 | SP1 | G23 | G24 | MO | SCL | MI
_bsilk: VIN | 3.3 | 1 | 0 | A7 | A6 | A5 | A4 | A3 | A2 | A1 | A0 | GND | RTS | ANT | VIN | GND | 2 | 3 | 4 | 5 | 6 | 7 | 8 | 9 | 10 | 11 | 12 | 13 | RST